# Altium schematic sheet Sheet1.SchDoc
size B; SheetNumber: 3; SheetTotal: 3
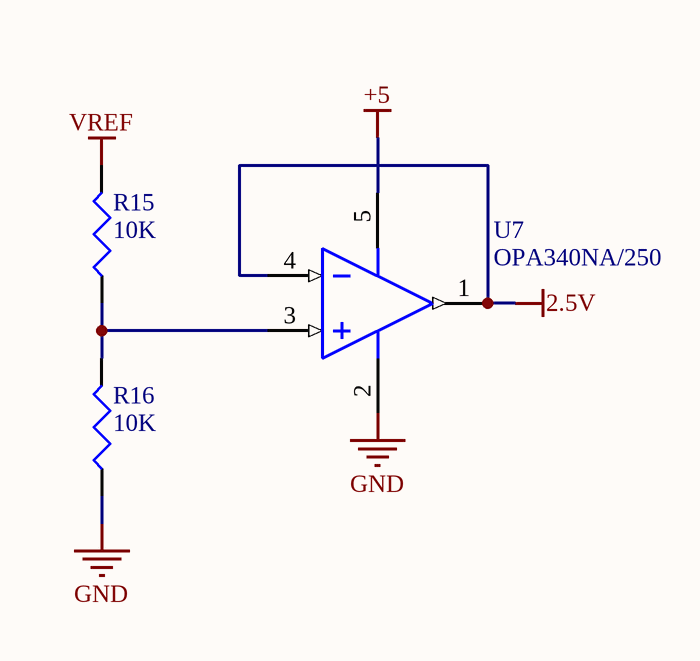
[diagram p0: Sheet1.SchDoc]

## Parts
R15  10K  [R_0402]
R16  10K  [R_0402]
U7  OPA340NA/250  [DBV0005A_M]

## Nets
2.5V: U7.1(OUT) U7.4(IN-)
+5: U7.5(V+)
GND: R16.1 U7.2(V-)
VREF: R15.2
NetR15_1: R15.1 R16.2 U7.3(IN+)

## Library data of the parts
R15 R16 = RES_0402
U7 = CMP-0272-00940-3: Single-Supply, Rail-to-Rail Operational Amplifier MicroAmplifier(TM) Series, 2.7 to 5.5 V, -40 to 85 degC, 5-pin SOT23 (DBV5), Green (RoHS & no Sb/Br); Manufacturer: Texas Instruments; CMRR(Min)(dB): 80; Slew Rate(Typ)(V/us): 6; Total Supply Voltage(Max)(+5V is 5, +/-5V is 10): 5.5; Vn at 1kHz(Typ)(nV/rtHz): 25; Iq per channel(Max)(mA): 0.95; Number of Channels: 1; IIB(Max)(pA): 10; Sub Family: Low Input Bias Current Amp (<=10pA), Low Offset Voltage Amplifier (<=500uV), Low Supply Voltage Amplifier (<=2.7V), Precision Amplifier; Total Supply Voltage(Min)(+5V is 5, +/-5V is 10): 2.7; Vio (25C)(Max)(mV): 0.5; Offset Drift(Typ)(uV/C): 2.5; Eco-Plan: Green (RoHS & no Sb/Br); Code_JEDEC: MO-178; PackageDescription: 5-Pin Plastic Small Outline, Body 1.6 x 2.9 mm, Pitch 0.95 mm; DatasheetVersion: SBOS073B; ComponentLink1URL: http://www.ti.com/; ComponentLink2URL: http://www.ti.com/general/docs/lit/getliterature.tsp?genericPartNumber=OPA340&fileType=pdf; ComponentLink2Description: Datasheet; ComponentLink3Description: Package Specification; ComponentLink1Description: Manufacturer URL; PackageReference: DBV0005A; ComponentLink3URL: http://www.ti.com/litv/pdf/mpds018i; PackageVersion: 4073253-4/K, 03/2006; Mounting Technology: Surface Mount; PartNumber: OPA340NA/250